# EAGLE design 202_9axis (EAGLE 7.6.0)
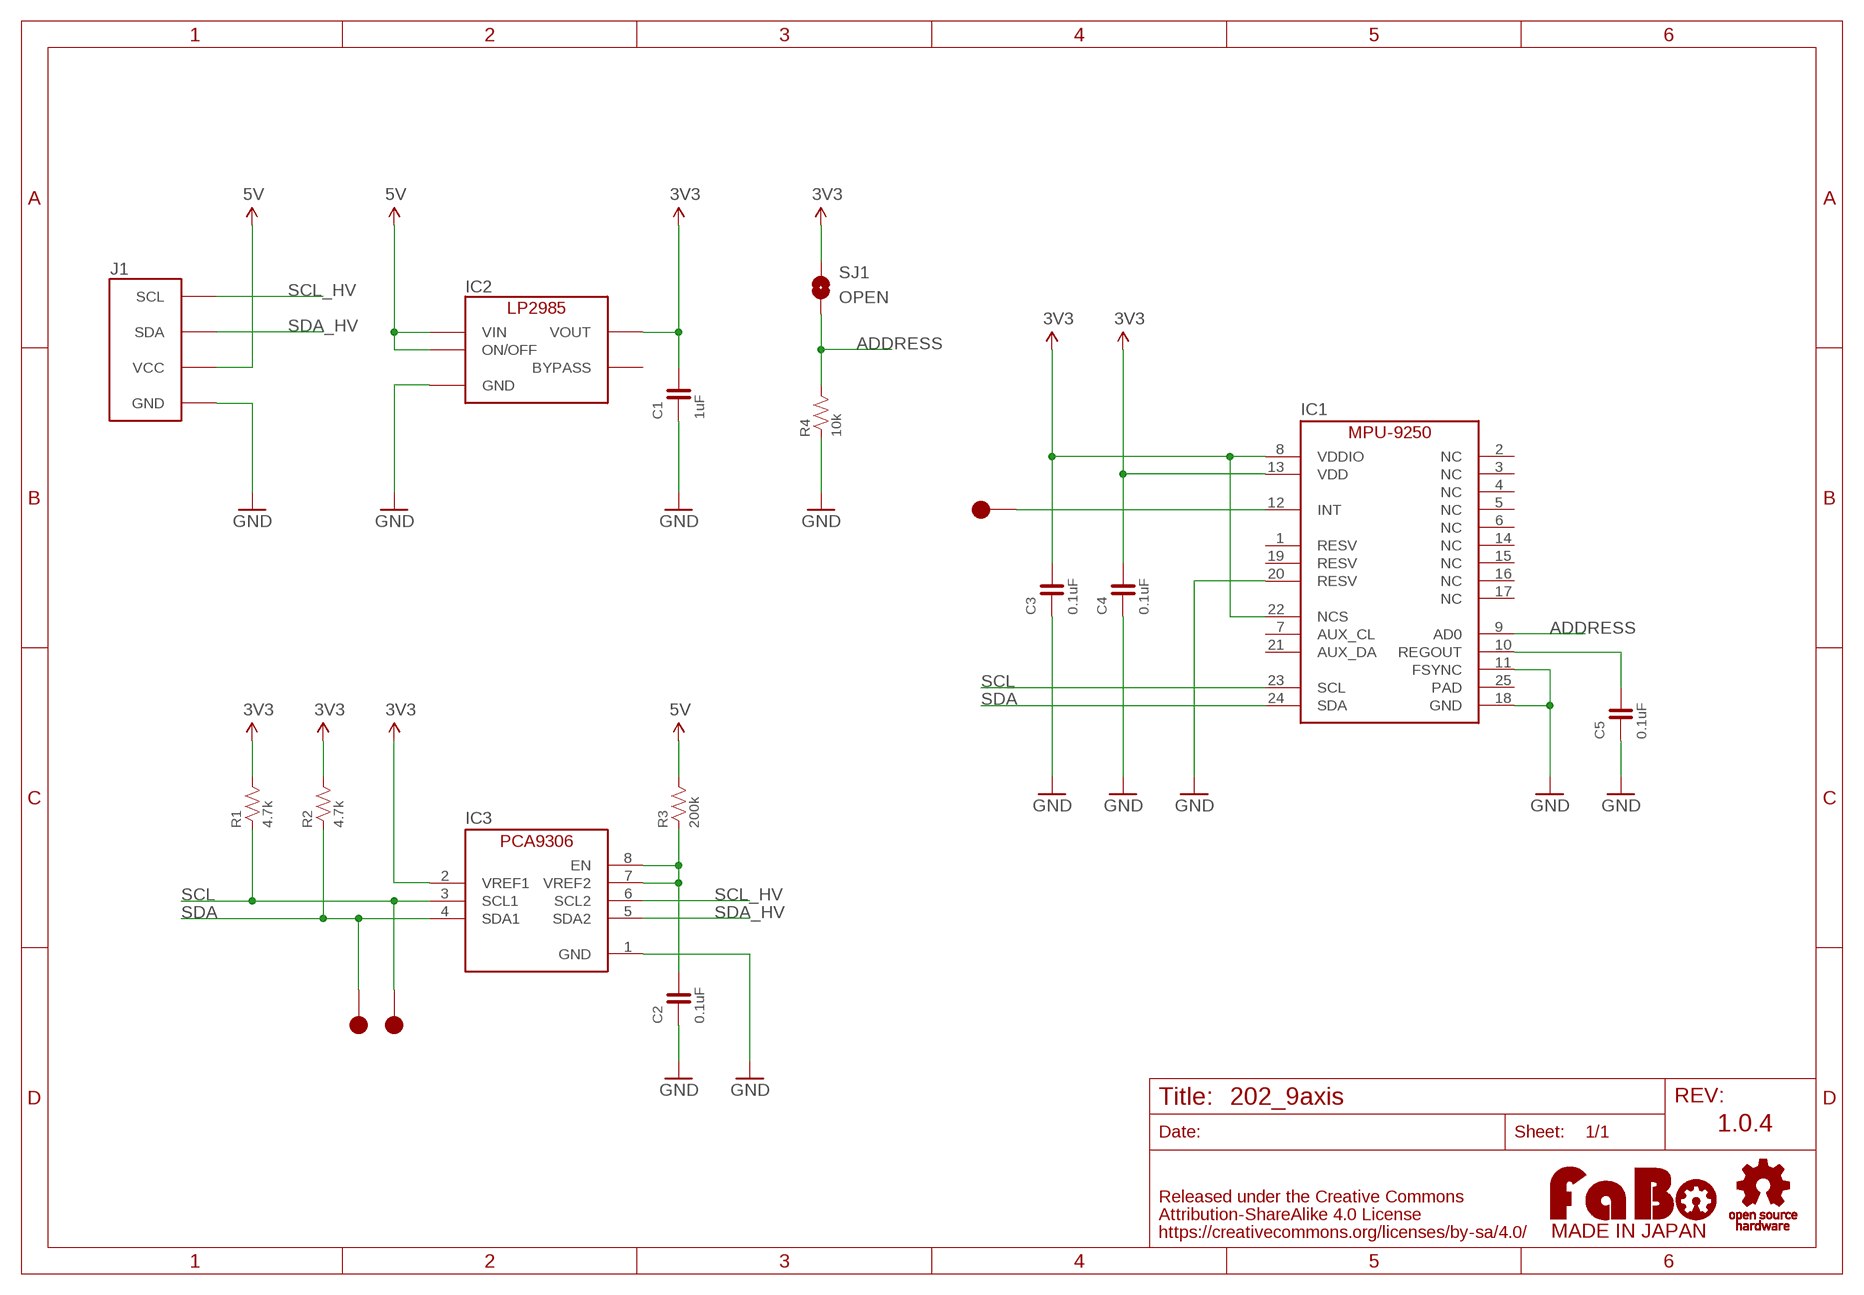
[diagram p0: schematic, sheet 1]

## Parts
C1  1uF  CAPACITOR-0603  [0603]
C2  0.1uF  CAPACITOR-0603  [0603]
C3  0.1uF  CAPACITOR-0603  [0603]
C4  0.1uF  CAPACITOR-0603  [0603]
C5  0.1uF  CAPACITOR-0603  [0603]
IC1  IS-MPU9250  [INVENSENSE-MPU9250]
IC2  LP2985-33DBV  [SOT-23-5]
IC3  PCA9306GM  [XQFN8]
J1  FABO_BRICK_I2C  [FABO_BRICK_I2C]
R1  4.7k  RESISTOR-0603  [0603]
R2  4.7k  RESISTOR-0603  [0603]
R3  200k  RESISTOR-0603  [0603]
R4  10k  RESISTOR-0603  [0603]
SJ1  OPEN  SMD-JUMPER-2-OPEN  [SMD-JUMPER-2-OPEN]
TP1  TP-15  [TP-15]
TP2  TP-15  [TP-15]
TP3  TP-15  [TP-15]
U$2  LOGO_OSHW-M_BOTTOM  [LOGO_OSHW_M_BOTTOM]
U$3  LOGO_FABO-M  [LOGO_FABO_MS]

## Nets
3V3: C1.2 C3.2 C4.2 IC1.8(VDDIO) IC1.13(VDD) IC1.22(NCS) IC2.5(VOUT) IC3.2(VREF1) R1.2 R2.2 SJ1.1
5V: IC2.1(VIN) IC2.3(ON/OFF) J1.VCC R3.2
ADDRESS: IC1.9(AD0) R4.2 SJ1.2
GND: C1.1 C2.1 C3.1 C4.1 C5.1 IC1.11(FSYNC) IC1.18(GND) IC1.20(RESV) IC2.2(GND) IC3.1(GND) J1.GND R4.1
N$1: C2.2 IC3.7(VREF2) IC3.8(EN) R3.1
N$2: IC1.12(INT) TP3.1
REGOUT: C5.2 IC1.10(REGOUT)
SCL: IC1.23(SCL) IC3.3(SCL1) R1.1 TP2.1
SCL_HV: IC3.6(SCL2) J1.SCL
SDA: IC1.24(SDA) IC3.4(SDA1) R2.1 TP1.1
SDA_HV: IC3.5(SDA2) J1.SDA
Unconnected: IC1.1(RESV) IC1.2(NC) IC1.3(NC) IC1.4(NC) IC1.5(NC) IC1.6(NC) IC1.7(AUX_CL) IC1.14(NC) IC1.15(NC) IC1.16(NC) IC1.17(NC) IC1.19(RESV) IC1.21(AUX_DA) IC1.25(PAD) IC2.4(BYPASS)

## Notes on the sheet
- 1.0.4

## Library data of the parts
C1-C5 = FaBo-Capacitor:CAPACITOR: CAPACITOR
IC1 = FaBo-Mems:IS-MPU9250: INVENSENSE MPU9250(9axis)
IC2 = FaBo-Supply:LP2985: LP2985
IC3 = FaBo-LevelTranslator:PCA9306
J1 = FaBo-Template:FABO_BRICK_I2C: FaBo Brick I2C
R1-R4 = FaBo-Resistors:RESISTOR: RESISTOR
SJ1 = FaBo-Supply:SMD-JUMPER-2
TP1-TP3 = FaBo-Supply:TP
U$2 = FaBo-etc:LOGO_OSHW
U$3 = FaBo-etc:LOGO_FABO

## Board
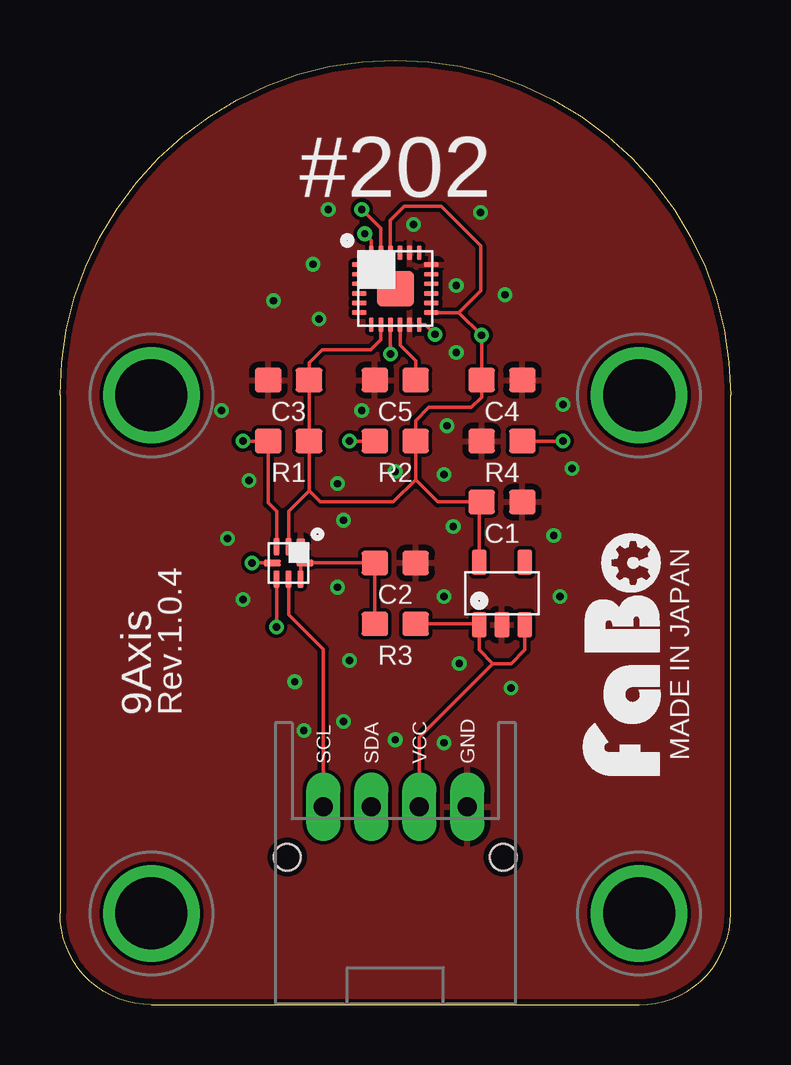
[diagram p1: board, top side]
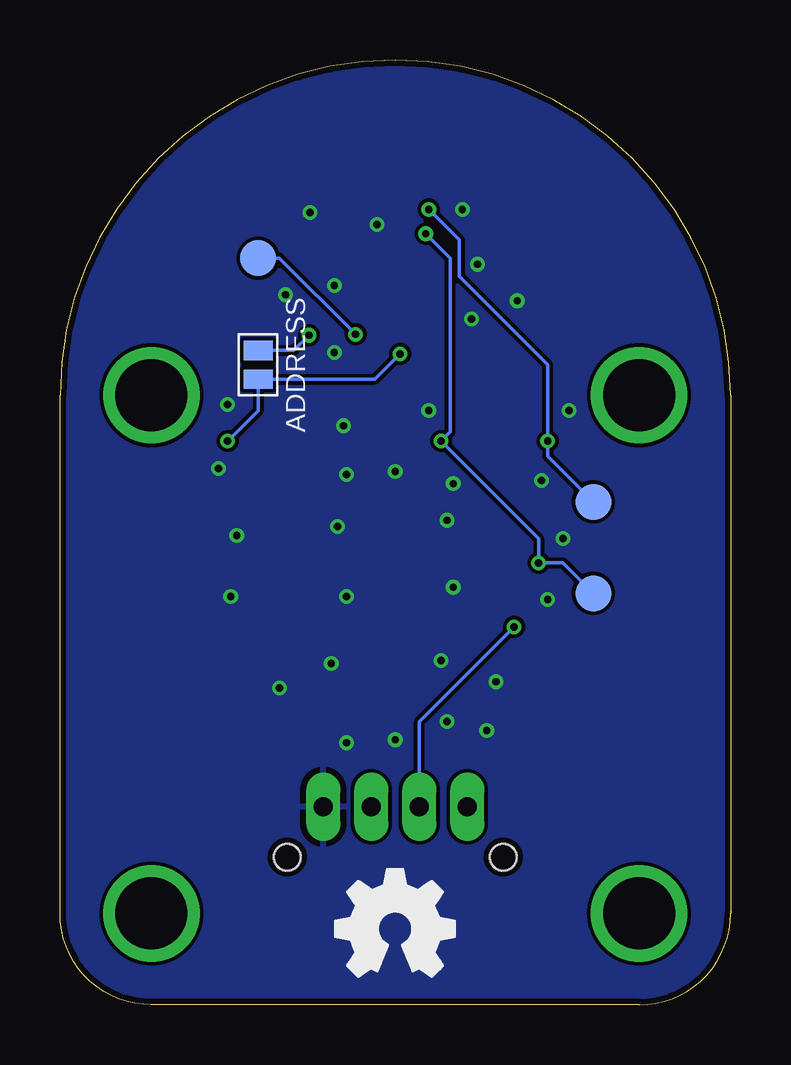
[diagram p2: board, bottom side, seen from below]

Size 27.94 x 39.37 mm. Coordinates in mm from the lower left corner, seen from the top.
Copper layers (1*16): Top 0.035mm / dielectric 1.5mm / Bottom 0.035mm
Design rules "SeeedStudio_2layer_DRU_no_angle_20140221": minimum track width 6mil, minimum drill 12mil, track to track 6mil, track to pad 6mil, pad to pad 6mil, via to via 6mil, smd to smd 0mil, copper to edge 10mil, drill to drill 10mil, minimum pad ring 10mil, minimum via ring 6mil, stop-mask expansion 2mil, vias tented up to drill 100mil, thermal gap 10mil

### Footprints (pad centres in the part's own frame; a part is rotated, then mirrored left to right if it is on the bottom)
0603 = smd 1.1 x 1: 1 -0.85,0; 2 0.85,0
INVENSENSE-MPU9250 = smd 0.6 x 0.2: 1 -1.5,1; 2 -1.5,0.6; 3 -1.5,0.2; 4 -1.5,-0.2; 5 -1.5,-0.6; 6 -1.5,-1; 13 1.5,-1; 14 1.5,-0.6; 15 1.5,-0.2; 16 1.5,0.2; 17 1.5,0.6; 18 1.5,1 | smd 0.2 x 0.6: 7 -1,-1.5; 8 -0.6,-1.5; 9 -0.2,-1.5; 10 0.2,-1.5; 11 0.6,-1.5; 12 1,-1.5; 19 1,1.5; 20 0.6,1.5; 21 0.2,1.5; 22 -0.2,1.5; 23 -0.6,1.5; 24 -1,1.5 | smd 1.55 x 1.49: 25 0,0
SOT-23-5 = smd 0.6 x 1.05: 1 -0.95,-1.3; 2 0,-1.3; 3 0.95,-1.3; 4 0.95,1.3; 5 -0.95,1.3
XQFN8 = smd 0.7 x 0.35: 1 -0.675,0.5 | smd 0.7 x 0.25: 2 -0.675,0; 3 -0.675,-0.5; 5 0.675,-0.5; 6 0.675,0; 7 0.675,0.5 | smd 0.25 x 0.7: 4 0,-0.675; 8 0,0.675
FABO_BRICK_I2C = drill 0.8 pad 1.422 long: GND 3,-10.795; SCL -3,-10.795; SDA -1,-10.795; VCC 1,-10.795 | drill 3 pad 3.81: P$1 -10.16,6.35; P$2 10.16,6.35; P$3 -10.16,-15.24; P$4 10.16,-15.24 | hole 1.1: -4.5,-12.895; 4.5,-12.895
SMD-JUMPER-2-OPEN = smd 0.8 x 1.2: 1 -0.6,0; 2 0.6,0
TP-15 = smd 1.5 x 1.5: 1 0,0

### Placement (x,y rotation side)
C1  18.41,20.95 180 top
C2  13.97,18.41 180 top
C3  9.53,26.04 0 top
C4  18.41,26.04 180 top
C5  13.97,26.04 0 top
IC1  13.97,29.84 0 top
IC2  18.41,17.14 0 top
IC3  9.53,18.41 270 top
J1  13.97,19.05 0 top
R1  9.53,23.5 0 top
R2  13.97,23.5 0 top
R3  13.97,15.88 0 top
R4  18.41,23.5 0 top
SJ1  19.68,26.67 270 bottom
TP1  5.71,17.14 0 bottom
TP2  5.71,20.95 0 bottom
TP3  19.68,31.11 0 bottom
U$2  13.97,3.17 0 top
U$3  25.4,14.61 90 top

### Tracks (layer width: path | path; a pad name or v marks a point on that pad's centre or on a via)
3V3  (via drill 0.3)
  Top 0.152: IC1.8 13.37,27.72 12.95,27.3 10.92,27.3 10.38,26.76 C3.2 R1.2 10.38,21.42 | 14.82,21.88 15.75,20.95 C1.2 17.46,20.86 IC2.5 | 14.82,21.88 R2.2 14.82,24.34 15.37,24.89 17.14,24.89 17.57,25.31 C4.2 v17.57,27.9 16.62,28.84 | 14.82,21.88 13.89,20.95 10.84,20.95 10.38,21.42 | IC1.13 16.62,28.84 | IC1.22 13.77,32.69 14.35,33.27 15.88,33.27 17.53,31.62 17.53,29.75 16.62,28.84 | IC3.2 9.53,20.57 10.38,21.42
  Bottom 0.152: SJ1.1 18.2,27.27 v17.57,27.9
5V
  Top 0.152: 18.03,14.22 17.46,14.79 IC2.1 17.43,15.88 R3.2 | IC2.3 19.36,14.79 18.8,14.22 18.03,14.22 | J1.VCC 14.97,11.16 18.03,14.22
ADDRESS  (via drill 0.3)
  Top 0.152: IC1.9 v13.77,27.12 | v20.95,23.5 R4.2
  Bottom 0.152: v13.77,27.12 14.82,26.07 SJ1.2 19.68,24.77 v20.95,23.5
GND  (via drill 0.3)
  other vias: 16.51,29.97 14.73,32.51 16.51,27.18 8.89,29.34 10.79,28.57 10.54,30.86 11.18,33.15 17.53,33.02 18.54,29.59 6.73,24.77 12.57,24.77 13.97,22.23 11.56,21.72 7.87,21.84 11.81,20.19 6.99,19.43 7.62,16.89 11.56,17.4 9.78,13.46 12.06,14.35 11.81,11.81 10.16,11.43 13.97,11.05 16,10.92 16.64,14.22 18.8,13.21 16,17.02 16.38,19.94 20.57,19.56 20.83,17.02 21.34,22.35 16,22.1 16.13,24.13 20.95,25.02
  pour Bottom: 0,0 27.94,0 27.94,39.37 0,39.37
  pour Top: 0,0 27.94,0 27.94,39.37 0,39.37
N$1
  Top 0.152: IC3.7 10.03,18.41 IC3.8 C2.2 R3.1
N$2  (via drill 0.3)
  Top 0.152: IC1.12 15.22,28.34 v15.62,27.94
  Bottom 0.152: TP3.1 18.8,31.11 v15.62,27.94
REGOUT
  Top 0.152: IC1.10 14.17,27.49 14.82,26.84 C5.2
SCL  (via drill 0.3)
  Top 0.152: IC3.3 9.03,20.57 8.68,20.92 R1.1 v7.62,23.5 | IC1.23 13.37,32.35 v12.57,33.15
  Bottom 0.152: v12.57,33.15 11.3,31.88 11.3,30.35 7.62,26.67 v7.62,23.5 7.62,22.86 TP2.1
SCL_HV
  Top 0.152: IC3.6 9.53,16.26 10.97,14.81 J1.SCL
SDA  (via drill 0.3)
  Top 0.152: IC1.24 12.97,31.86 v12.7,32.13 | R2.1 v12.06,23.5 | IC3.4 v8,18.41
  Bottom 0.152: v12.7,32.13 11.68,31.11 11.68,23.88 v12.06,23.5 8,19.43 v8,18.41 6.99,18.41 TP1.1
SDA_HV  (via drill 0.3)
  Top 0.152: IC3.5 v9.03,15.76 v9.02,15.75
  Bottom 0.152: J1.SDA 12.97,11.79 v9.02,15.75

### Text on the board
tPlace: #202 | MADE IN JAPAN | 9Axis | Rev.1.0.4
bPlace: ADDRESS